# Altium schematic sheet robot rev3.SchDoc: Selfbalancing robot
size A1; DrawnBy: Sebastian Nilsson; PageSetup: Record=PageOptions|CenterHorizontal=True|CenterVertical=True|PrintScale=0.47|XCorrection=1.00|YCorrection=1.00|PrintKind=0|BorderSize=5000000|LeftOffset=0|BottomOffset=0|Orientation=2|PaperLength=1000|PaperWidth=1000|Scale=100|PaperSource=7|PrintQuality=-4|MediaType=1|DitherType=10|PaperKind=A4|PrintScaleMode=1
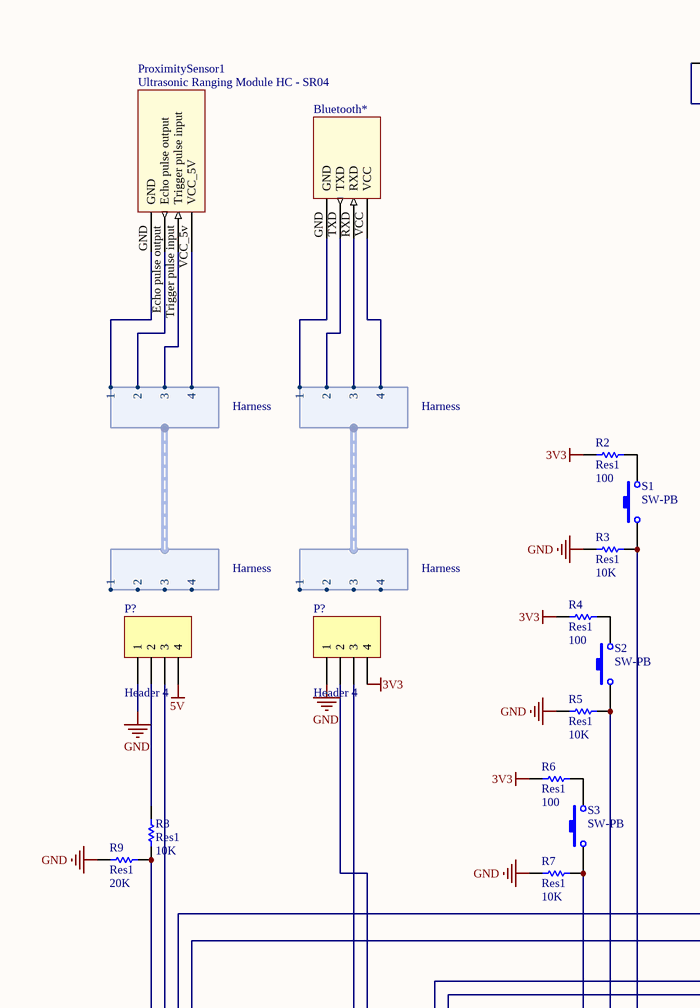
[diagram p0: robot rev3.SchDoc, top left]
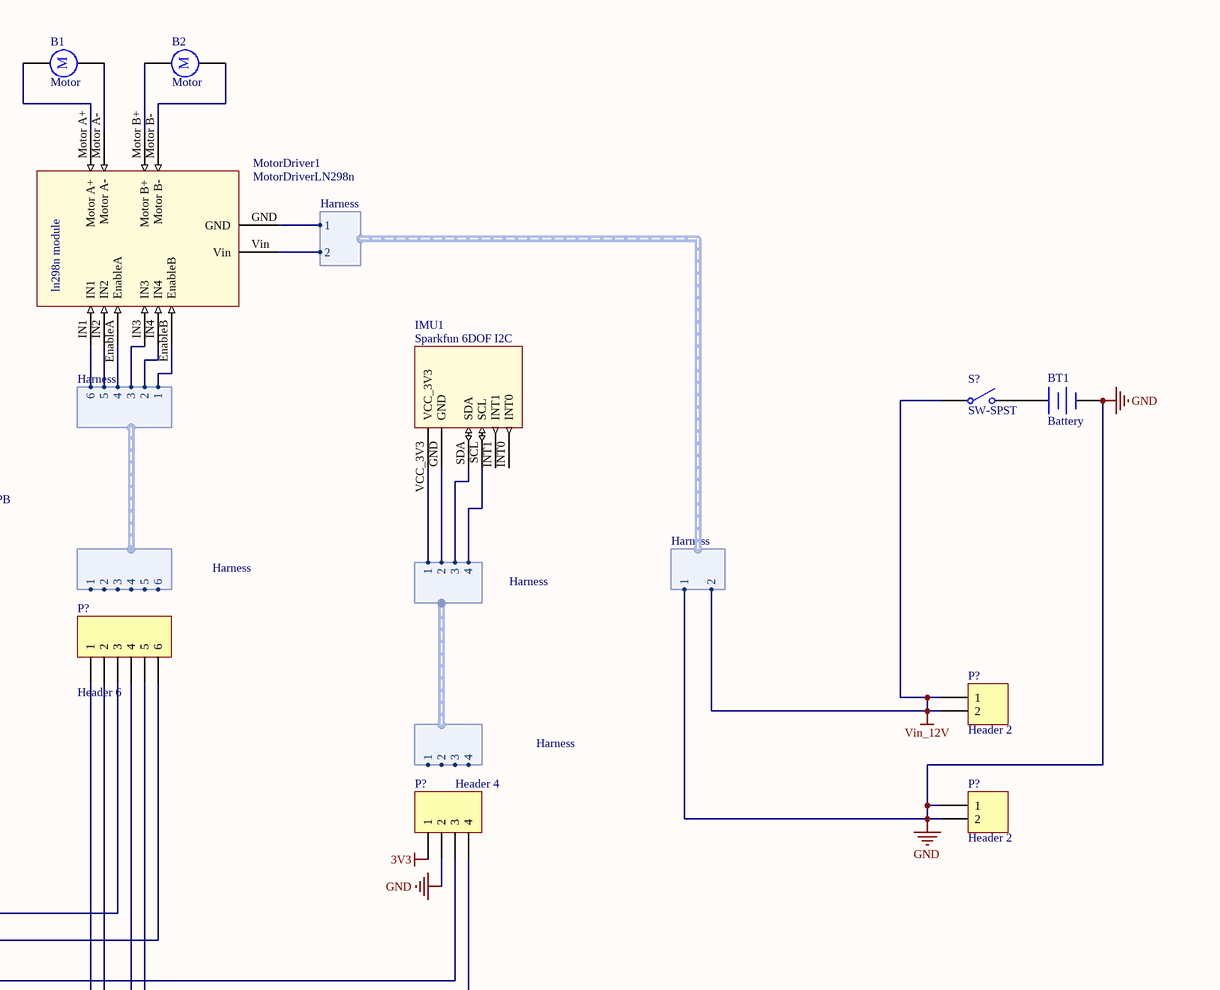
[diagram p1: robot rev3.SchDoc, top right]
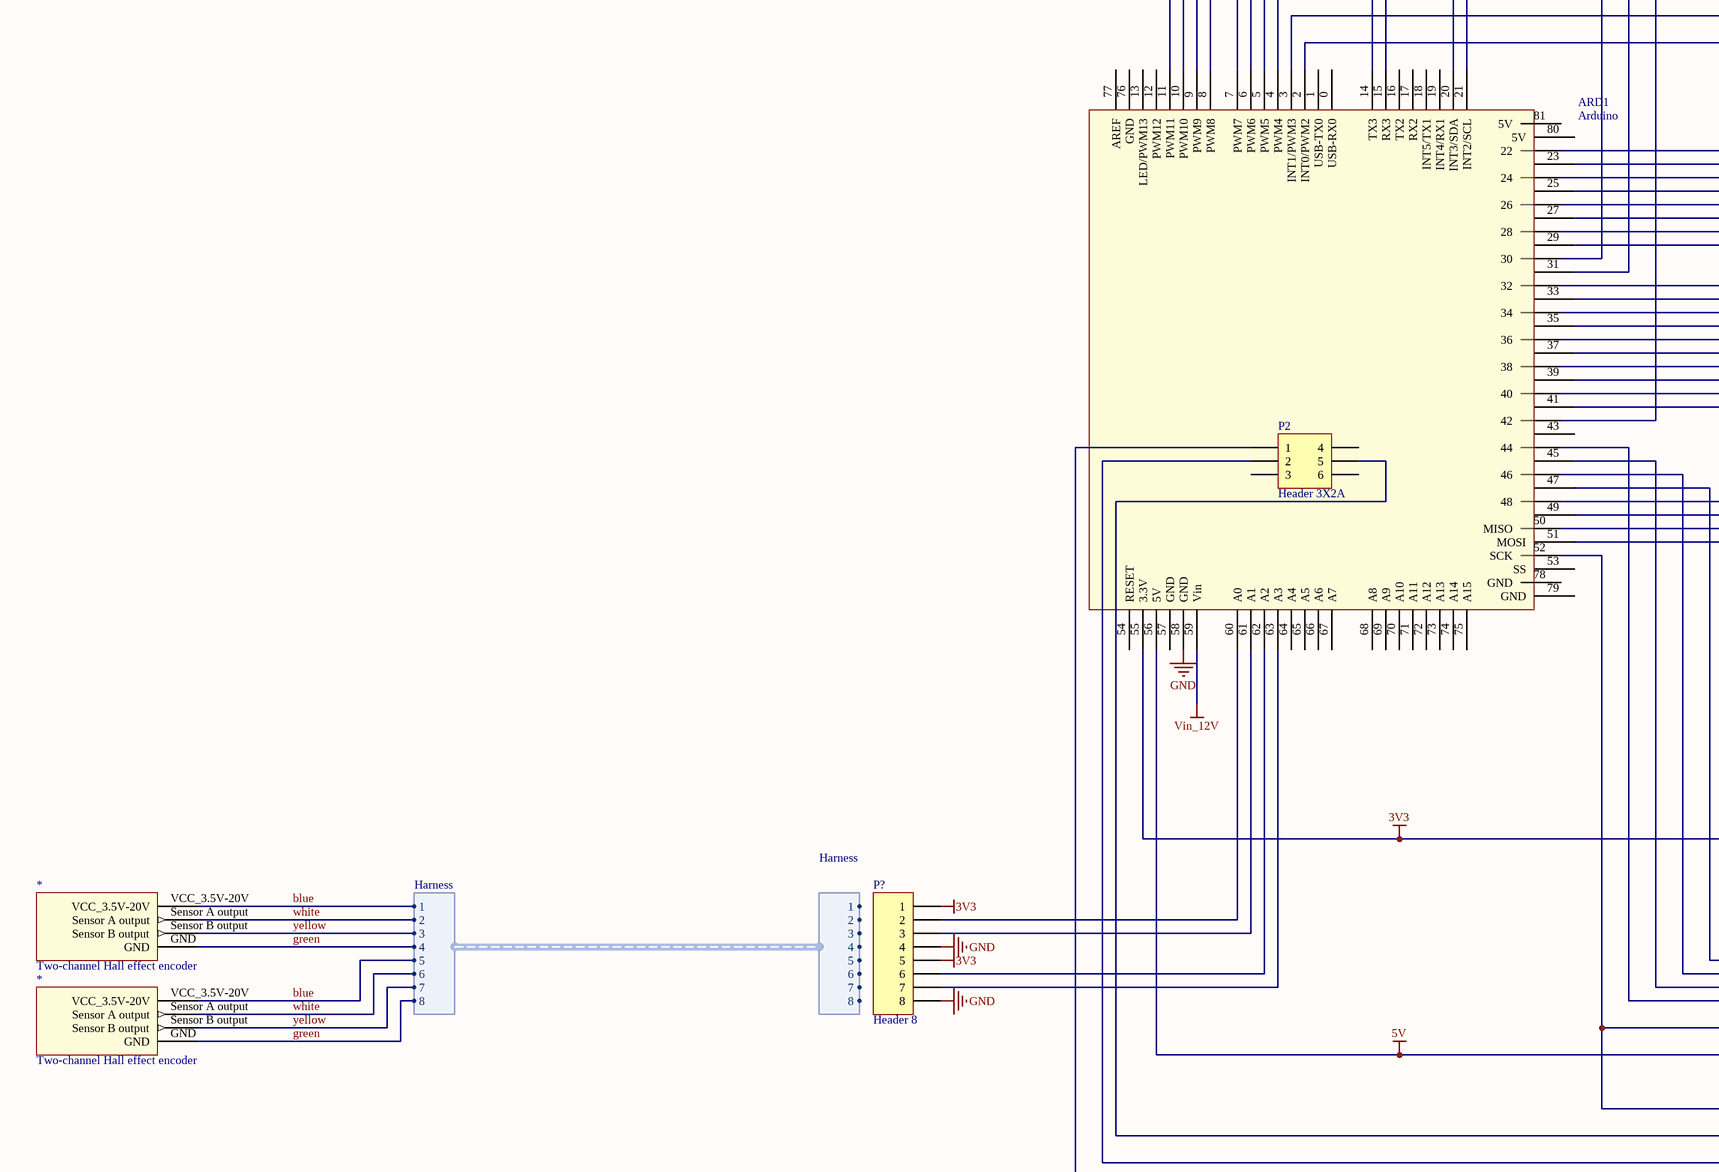
[diagram p2: robot rev3.SchDoc, bottom left]
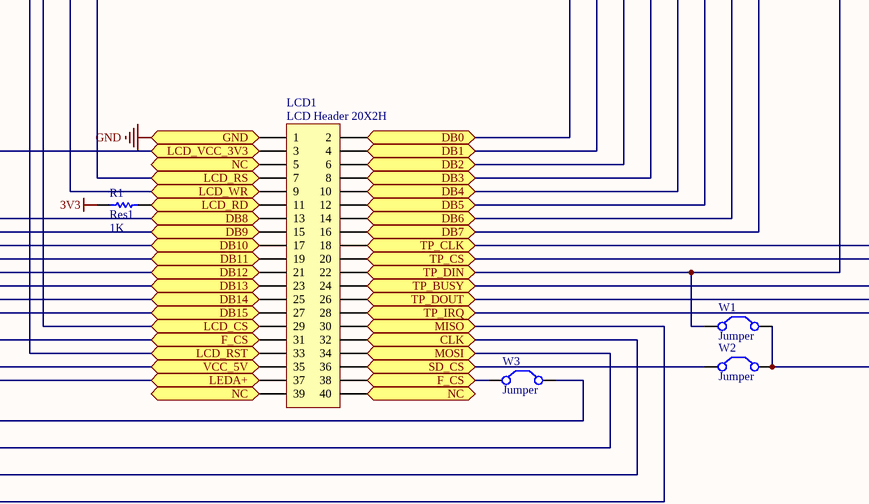
[diagram p3: robot rev3.SchDoc, bottom right]

## Parts
(Parts that share a designator on the sheet are numbered #1, #2 ... from top to bottom, then left to right.)
*#1  Two-channel Hall effect encoder
*#2  Two-channel Hall effect encoder
ARD1  Arduino  [Arduino]
B1  Motor  [RB5-10.5]
B2  Motor  [RB5-10.5]
Bluetooth*  Generic 4pin Bluetooth module  (value not drawn)
BT1  Battery  [BAT-2]
IMU1  Sparkfun 6DOF I2C
LCD1  LCD Header 20X2H  [HDR2X20H]
MotorDriver1  MotorDriverLN298n
P2  Header 3X2A  [HDR2X3_CEN]
P?#1  Header 4  [HDR1X4]
P?#2  Header 4  [HDR1X4]
P?#3  Header 6  [HDR1X6]
P?#4  Header 2  [HDR1X2]
P?#5  Header 2  [HDR1X2]
P?#6  Header 4  [HDR1X4]
P?#7  Header 8  [HDR1X8]
ProximitySensor1  Ultrasonic Ranging Module HC - SR04
R1  Res1  value 1K  [AXIAL-0.3]
R2  Res1  value 100  [AXIAL-0.3]
R3  Res1  value 10K  [AXIAL-0.3]
R4  Res1  value 100  [AXIAL-0.3]
R5  Res1  value 10K  [AXIAL-0.3]
R6  Res1  value 100  [AXIAL-0.3]
R7  Res1  value 10K  [AXIAL-0.3]
R8  Res1  value 10K  [AXIAL-0.3]
R9  Res1  value 20K  [AXIAL-0.3]
S1  SW-PB  [SPST-2]
S2  SW-PB  [SPST-2]
S3  SW-PB  [SPST-2]
S?  SW-SPST  [SPST-2]
W1  Jumper  [RAD-0.2]
W2  Jumper  [RAD-0.2]
W3  Jumper  [RAD-0.2]

## Ports
CLK, DB0, DB1, DB2, DB3, DB4, DB5, DB6, DB7, DB8, DB9, DB10, DB11, DB12, DB13, DB14, DB15, F_CS, GND, LCD_CS, LCD_RD, LCD_RS, LCD_RST, LCD_VCC_3V3, LCD_WR, LEDA+, MISO, MOSI, NC, SD_CS, TP_BUSY, TP_CLK, TP_CS, TP_DIN, TP_DOUT, TP_IRQ, VCC_5V

## Harnesses
Harness: 1, 2, 3, 4
Harness: 1, 2, 3, 4, 5, 6
Harness: 1, 2, 3, 4, 5, 6, 7, 8
Harness: 1, 2

## Nets
3V3: ARD1.55(3.3V) LCD1.3 P?#2.4 P?#6.1 P?#7.1 P?#7.5 R1.1 R2.2 R4.2 R6.2 ; port LCD_VCC_3V3
5V: ARD1.56(5V) LCD1.35 P?#1.4 ; port VCC_5V
GND: ARD1.58(GND) BT1.2(-) LCD1.1 MotorDriver1.GND P?#1.1 P?#2.1 P?#5.1 P?#5.2 P?#6.2 P?#7.4 P?#7.8 R3.1 R5.1 R7.1 R9.2 ; port GND, harness Harness.1
Vin_12V: ARD1.59(Vin) MotorDriver1.Vin P?#4.1 P?#4.2 S?.1(COMMON) ; harness Harness.2
blue: *#1.VCC_3.5V-20V *#2.VCC_3.5V-20V ; harness Harness.1, harness Harness.5
CLK: LCD1.32 P2.2 ; port CLK
DB0: ARD1.33 LCD1.2 ; port DB0
DB1: ARD1.34 LCD1.4 ; port DB1
DB2: ARD1.35 LCD1.6 ; port DB2
DB3: ARD1.36 LCD1.8 ; port DB3
DB4: ARD1.37 LCD1.10 ; port DB4
DB5: ARD1.38 LCD1.12 ; port DB5
DB6: ARD1.39 LCD1.14 ; port DB6
DB7: ARD1.40 LCD1.16 ; port DB7
DB8: ARD1.51(MOSI) LCD1.13 ; port DB8
DB9: ARD1.50(MISO) LCD1.15 ; port DB9
DB10: ARD1.49 LCD1.17 ; port DB10
DB11: ARD1.48 LCD1.19 ; port DB11
DB12: ARD1.47 LCD1.21 ; port DB12
DB13: ARD1.46 LCD1.23 ; port DB13
DB14: ARD1.45 LCD1.25 ; port DB14
DB15: ARD1.44 LCD1.27 ; port DB15
F_CS: ARD1.52(SCK) LCD1.31 LCD1.38 W3.1(C1) W3.2(C2) ; port F_CS
green: *#1.GND *#2.GND ; harness Harness.4, harness Harness.8
LCD_CS: ARD1.27 LCD1.29 ; port LCD_CS
LCD_RD: LCD1.11 R1.2 ; port LCD_RD
LCD_RS: ARD1.25 LCD1.7 ; port LCD_RS
LCD_RST: ARD1.28 LCD1.33 ; port LCD_RST
LCD_WR: ARD1.26 LCD1.9 ; port LCD_WR
LEDA+: ARD1.41 LCD1.37 ; port LEDA+
MISO: LCD1.30 P2.1 ; port MISO
MOSI: LCD1.34 P2.5 ; port MOSI
NC: LCD1.5 LCD1.39 LCD1.40 ; port NC
SD_CS: LCD1.36 W2.1(C1) ; port SD_CS
TP_BUSY: ARD1.7(PWM7) LCD1.24 ; port TP_BUSY
TP_CLK: ARD1.6(PWM6) LCD1.18 ; port TP_CLK
TP_CS: ARD1.5(PWM5) LCD1.20 ; port TP_CS
TP_DIN: ARD1.32 LCD1.22 W1.1(C1) ; port TP_DIN
TP_DOUT: ARD1.3(INT1/PWM3) LCD1.26 ; port TP_DOUT
TP_IRQ: ARD1.2(INT0/PWM2) LCD1.28 ; port TP_IRQ
white: *#1.Sensor_A_output *#2.Sensor_A_output ; harness Harness.2, harness Harness.6
yellow: *#1.Sensor_B_output *#2.Sensor_B_output ; harness Harness.3, harness Harness.7
NetARD1_4: ARD1.4(PWM4) W1.2(C2) W2.2(C2)
NetARD1_8: ARD1.8(PWM8) P?#3.6
NetARD1_9: ARD1.9(PWM9) P?#3.3
NetARD1_10: ARD1.10(PWM10) P?#1.3
NetARD1_11: ARD1.11(PWM11) R8.1 R9.1
NetARD1_14: ARD1.14(TX3) P?#2.3
NetARD1_15: ARD1.15(RX3) P?#2.2
NetARD1_20: ARD1.20(INT3/SDA) P?#6.3
NetARD1_21: ARD1.21(INT2/SCL) P?#6.4
NetARD1_22: ARD1.22 P?#3.1
NetARD1_23: ARD1.23 P?#3.2
NetARD1_24: ARD1.24 P?#3.4
NetARD1_29: ARD1.29 P?#3.5
NetARD1_30: ARD1.30 R7.2 S3.1
NetARD1_31: ARD1.31 R5.2 S2.1
NetARD1_42: ARD1.42 R3.2 S1.1
NetARD1_60: ARD1.60(A0) P?#7.2
NetARD1_61: ARD1.61(A1) P?#7.3
NetARD1_62: ARD1.62(A2) P?#7.6
NetARD1_63: ARD1.63(A3) P?#7.7
NetB1_1: B1.1 MotorDriver1.Motor_A+
NetB1_2: B1.2 MotorDriver1.Motor_A-
NetB2_1: B2.1 MotorDriver1.Motor_B+
NetB2_2: B2.2 MotorDriver1.Motor_B-
NetBluetooth*_GND: Bluetooth*.GND ; harness Harness.1
NetBluetooth*_RXD: Bluetooth*.RXD ; harness Harness.3
NetBluetooth*_TXD: Bluetooth*.TXD ; harness Harness.2
NetBluetooth*_VCC: Bluetooth*.VCC ; harness Harness.4
NetBT1_1: BT1.1(+) S?.2(NO)
NetIMU1_GND: IMU1.GND ; harness Harness.2
NetIMU1_SCL: IMU1.SCL ; harness Harness.4
NetIMU1_SDA: IMU1.SDA ; harness Harness.3
NetIMU1_VCC_3V3: IMU1.VCC_3V3 ; harness Harness.1
NetMotorDriver1_EnableA: MotorDriver1.EnableA ; harness Harness.4
NetMotorDriver1_EnableB: MotorDriver1.EnableB ; harness Harness.1
NetMotorDriver1_IN1: MotorDriver1.IN1 ; harness Harness.6
NetMotorDriver1_IN2: MotorDriver1.IN2 ; harness Harness.5
NetMotorDriver1_IN3: MotorDriver1.IN3 ; harness Harness.3
NetMotorDriver1_IN4: MotorDriver1.IN4 ; harness Harness.2
NetP?#1_2: P?#1.2 R8.2
NetProximitySensor1_Echo pulse output: ProximitySensor1.Echo_pulse_output ; harness Harness.2
NetProximitySensor1_GND: ProximitySensor1.GND ; harness Harness.1
NetProximitySensor1_Trigger pulse input: ProximitySensor1.Trigger_pulse_input ; harness Harness.3
NetProximitySensor1_VCC_5v: ProximitySensor1.VCC_5v(VCC_5V) ; harness Harness.4
NetR2_1: R2.1 S1.2
NetR4_1: R4.1 S2.2
NetR6_1: R6.1 S3.2

Not connected (* = marked no-connect by the designer): ARD1 0(USB-RX0) 1(USB-TX0) 12(PWM12) 13(LED/PWM13) 16(TX2) 17(RX2) 18(INT5/TX1) 19(INT4/RX1) 43 53(SS) 54(RESET) 57(GND) 64(A4) 65(A5) 66(A6) 67(A7) 68(A8) 69(A9) 70(A10) 71(A11) 72(A12) 73(A13) 74(A14) 75(A15) 76(GND) 77(AREF) 78(GND) 79(GND) 80(5V) 81(5V); IMU1 INT0 INT1; P2 3 4 6

## Notes on the sheet
- (in symbol Motor) M
- (in symbol MotorDriverLN298n) ln298n module

## Library data of the parts
B1 B2 = Motor: Motor, General Kind; Published: 24-Mar-1999; LatestRevisionDate: 17-Jul-2002; LatestRevisionNote: Re-released for DXP Platform.; PackageReference: RB5-10.5; Publisher: Altium Limited; PackageDescription: Capacitor (Radial); 2 Leads
BT1 = Battery: Multicell Battery; Published: 24-Mar-1999; LatestRevisionDate: 17-Jul-2002; LatestRevisionNote: Re-released for DXP Platform.; PackageReference: BAT-2; Publisher: Altium Limited; PackageDescription: Battery; 2 Leads
LCD1 = Header 20X2H: Header, 20-Pin, Dual row, Right Angle; LatestRevisionDate: 17-Jul-2002; LatestRevisionNote: Re-released for DXP Platform.; Publisher: Altium Limited
MotorDriver1 = MotorDriverLN298n: Motor driver module ln298n
P2 = Header 3X2A: Header, 3-Pin, Dual row; LatestRevisionDate: 17-Jul-2002; LatestRevisionNote: Re-released for DXP Platform.; Publisher: Altium Limited
P?#1 P?#2 P?#6 = Header 4: Header, 4-Pin; LatestRevisionDate: 17-Jul-2002; LatestRevisionNote: Re-released for DXP Platform.; Publisher: Altium Limited
P?#3 = Header 6: Header, 6-Pin; LatestRevisionDate: 17-Jul-2002; LatestRevisionNote: Re-released for DXP Platform.; Publisher: Altium Limited
P?#4 P?#5 = Header 2: Header, 2-Pin; LatestRevisionDate: 17-Jul-2002; LatestRevisionNote: Re-released for DXP Platform.; Publisher: Altium Limited
P?#7 = Header 8: Header, 8-Pin; LatestRevisionDate: 17-Jul-2002; LatestRevisionNote: Re-released for DXP Platform.; Publisher: Altium Limited
R1-R9 = Res1: Resistor; Published: 8-Jun-2000; LatestRevisionDate: 17-Jul-2002; LatestRevisionNote: Re-released for DXP Platform.; PackageReference: AXIAL-0.3; Publisher: Altium Limited; PackageDescription: Axial Device, Thru-Hole; 2 Leads; 0.3 in Pin Spacing
S1-S3 = SW-PB: Switch; Published: 24-Mar-1999; LatestRevisionDate: 17-Jul-2002; LatestRevisionNote: Re-released for DXP Platform.; PackageReference: SPST-2; Publisher: Altium Limited; PackageDescription: Switch; 2 Leads
S? = SW-SPST: Single-Pole, Single-Throw Switch; Published: 24-Mar-1999; LatestRevisionDate: 17-Jul-2002; LatestRevisionNote: Re-released for DXP Platform.; PackageReference: SPST-2; Publisher: Altium Limited; PackageDescription: Switch; 2 Leads
W1-W3 = Jumper: Jumper Wire; Published: 24-Mar-1999; LatestRevisionDate: 17-Jul-2002; LatestRevisionNote: Re-released for DXP Platform.; PackageReference: RAD-0.2; Publisher: Altium Limited; PackageDescription: Radial Cap, Thru-Hole; 2 Leads; 0.2 in Pin Spacing